# EAGLE design Carrier Board (EAGLE 9.6.2)

## Sheet 1 of 5: Sensors
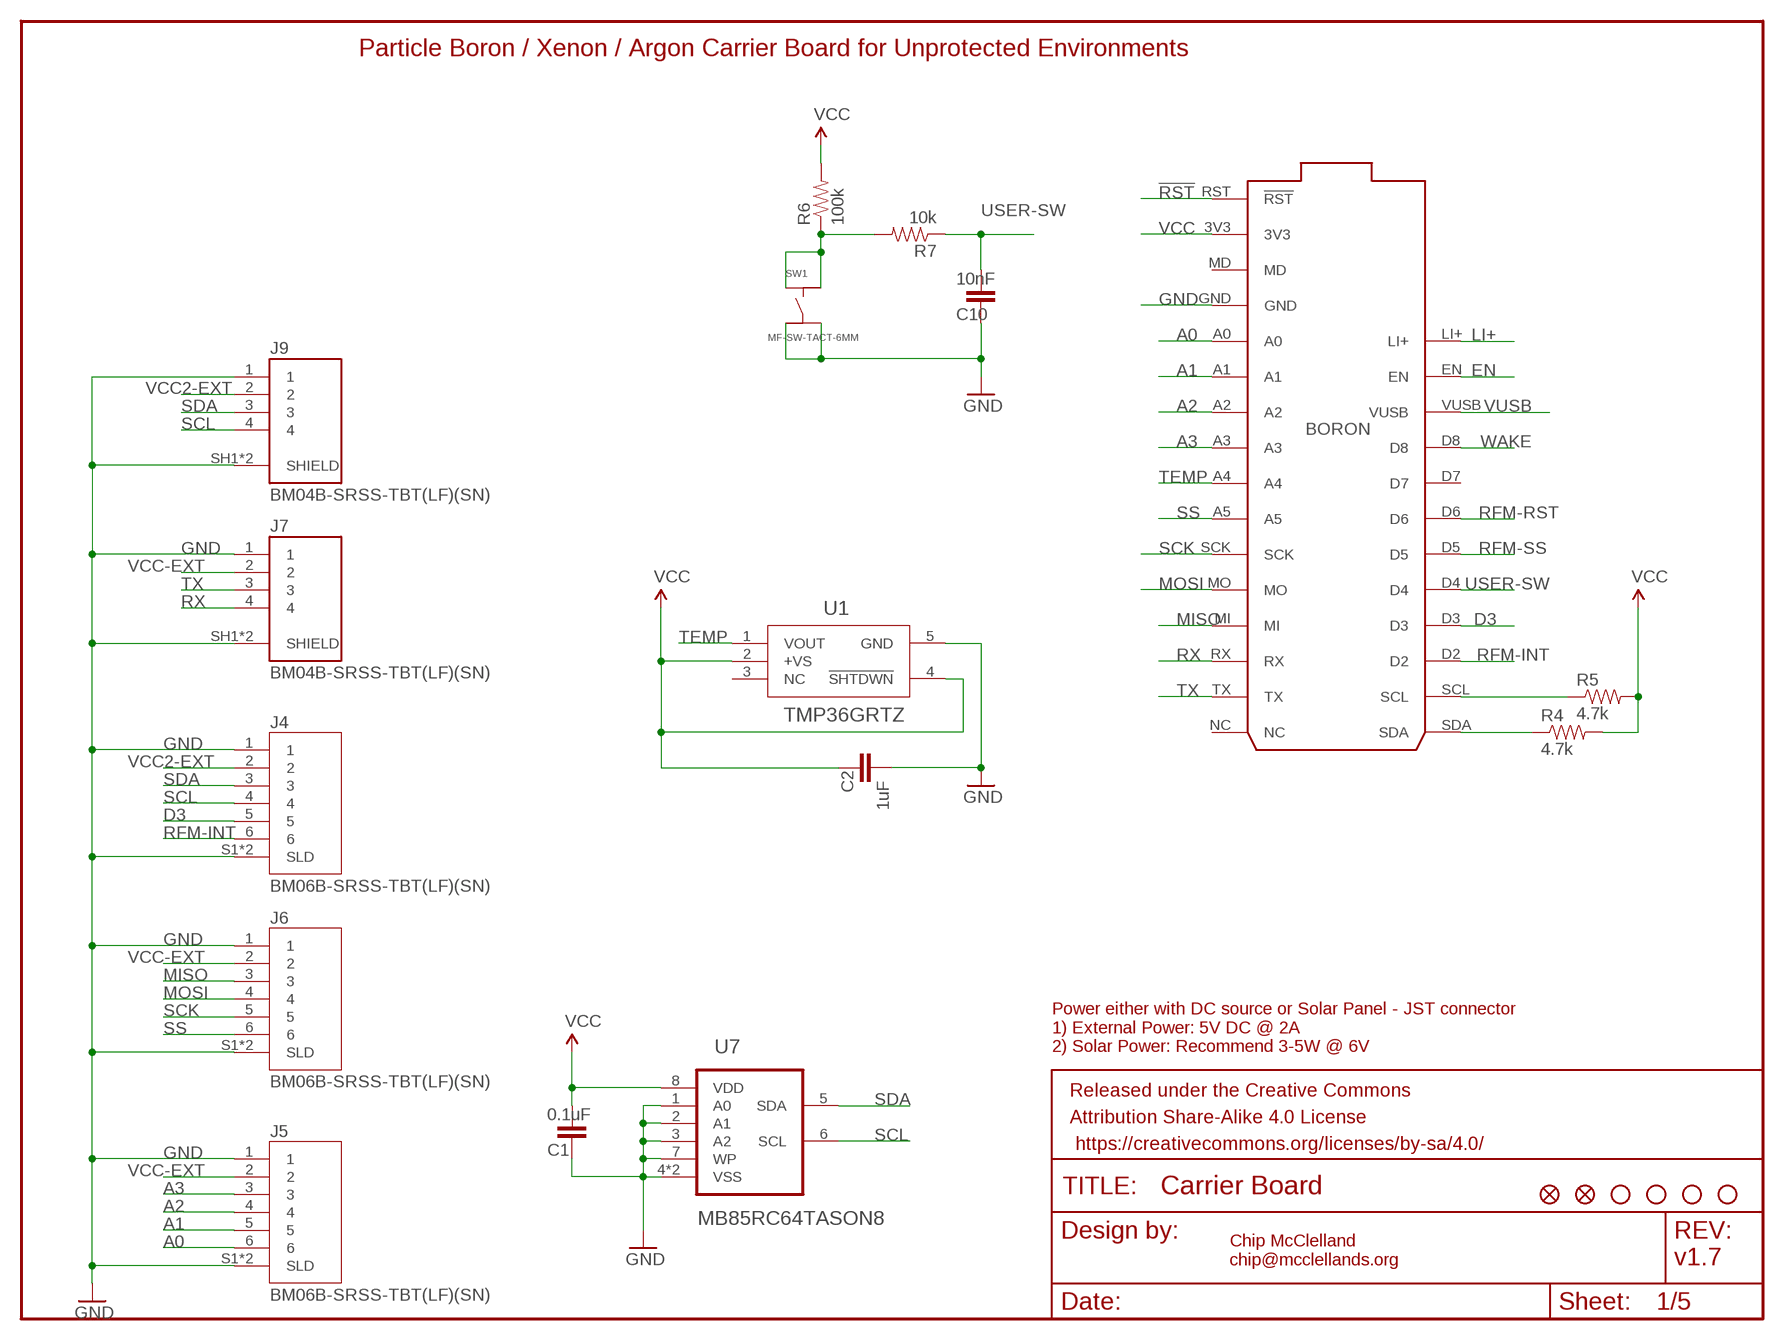
[diagram p0: schematic, sheet 1]

### Parts
C1  0.1uF  CAP-MF-0.1UF-0805  [0805@1]
C2  1uF  CAP-MF-1UF-0805  [0805@1]
C10  10nF  CAP-10NF-0805  [0805@1]
FD1  FIDUCIALUFIDUCIAL  [FIDUCIAL-MICRO]
FD2  FIDUCIALUFIDUCIAL  [FIDUCIAL-MICRO]
FRAME1  FRAME-LETTER  [CREATIVE_COMMONS]
J4  BM06B-SRSS-TBT(LF)(SN)  [JST_BM06B-SRSS-TB(LF)(SN)]
J5  BM06B-SRSS-TBT(LF)(SN)  [JST_BM06B-SRSS-TB(LF)(SN)]
J6  BM06B-SRSS-TBT(LF)(SN)  [JST_BM06B-SRSS-TB(LF)(SN)]
J7  BM04B-SRSS-TBT(LF)(SN)  [CONN_BM04B-SRSS-TBT(LF)(SN)]
J9  BM04B-SRSS-TBT(LF)(SN)  [CONN_BM04B-SRSS-TBT(LF)(SN)]
JP3  STAND-OFF  [STAND-OFF]
JP4  STAND-OFF  [STAND-OFF]
JP5  STAND-OFF  [STAND-OFF]
JP6  STAND-OFF  [STAND-OFF]
P1  Particle Boron / Xenon / Argon  PARTICLE-DEVICES-BORON  [PARTICLE-DEVICES_BORON]
R4  4.7k  RESISTOR-MF-4.7K-0805  [0805]
R5  4.7k  RESISTOR-MF-4.7K-0805  [0805]
R6  100k  RESISTOR-MF-100K-0805  [0805]
R7  10k  RESISTOR-MF-10K-0805  [0805]
SW1  MF-SW-TACT-6MM  TACT_6MM  [TACT6MM]
U1  TMP36GRTZ  TMP36GRTZ-REEL7  [RJ_5_ADI]
U7  MB85RC64TASON8  [SON50P200X300X75-9N]

### Nets
!RST: P1.RST(!RST) ; also sheet 4
A0: J5.6 P1.A0
A1: J5.5 P1.A1
A2: J5.4 P1.A2
A3: J5.3 P1.A3
D3: J4.5 P1.D3 ; also sheet 3
EN: P1.EN ; also sheet 4
GND: C1.2 C2.2 C10.2 J4.1 J4.S1(SLD) J4.S2(SLD) J5.1 J5.S1(SLD) J5.S2(SLD) J6.1 J6.S1(SLD) J6.S2(SLD) J7.1 J7.SH1(SHIELD) J7.SH2(SHIELD) J9.1 J9.SH1(SHIELD) J9.SH2(SHIELD) P1.GND SW1.P$3 SW1.P$4 U1.5(GND) U7.1(A0) U7.2(A1) U7.3(A2) U7.4(VSS) U7.7(WP) U7.9(VSS) ; also sheet 2,3,4
LI+: P1.LI+ ; also sheet 3
MISO: J6.3 P1.MI ; also sheet 2
MOSI: J6.4 P1.MO ; also sheet 2
N$4: R6.1 R7.2 SW1.P$1 SW1.P$2
RFM-INT: J4.6 P1.D2 ; also sheet 2,3
RFM-RST: P1.D6 ; also sheet 2
RFM-SS: P1.D5 ; also sheet 2
RX: J7.4 P1.RX
SCK: J6.5 P1.SCK ; also sheet 2
SCL: J4.4 J9.4 P1.SCL R5.1 U7.6(SCL) ; also sheet 3,4
SDA: J4.3 J9.3 P1.SDA R4.1 U7.5(SDA) ; also sheet 3,4
SS: J6.6 P1.A5
TEMP: P1.A4 U1.1(VOUT)
TX: J7.3 P1.TX
USER-SW: C10.1 P1.D4 R7.1
VCC: C1.1 C2.1 P1.3V3 R4.2 R5.2 R6.2 U1.2(+VS) U1.4(!SHTDWN) U7.8(VDD) ; also sheet 2,3
VCC2-EXT: J4.2 J9.2 ; also sheet 3
VCC-EXT: J5.2 J6.2 J7.2 ; also sheet 3
VUSB: P1.VUSB ; also sheet 3
WAKE: P1.D8 ; also sheet 4
Unconnected: P1.D7 P1.MD P1.NC U1.3(NC)

### Notes on the sheet
- Particle Boron / Xenon / Argon Carrier Board for Unprotected Environments
- Power either with DC source or Solar Panel - JST connector
  1) External Power: 5V DC @ 2A 
  2) Solar Power: Recommend 3-5W @ 6V
- Chip McClelland
  chip@mcclellands.org
- v1.7

## Sheet 2 of 5
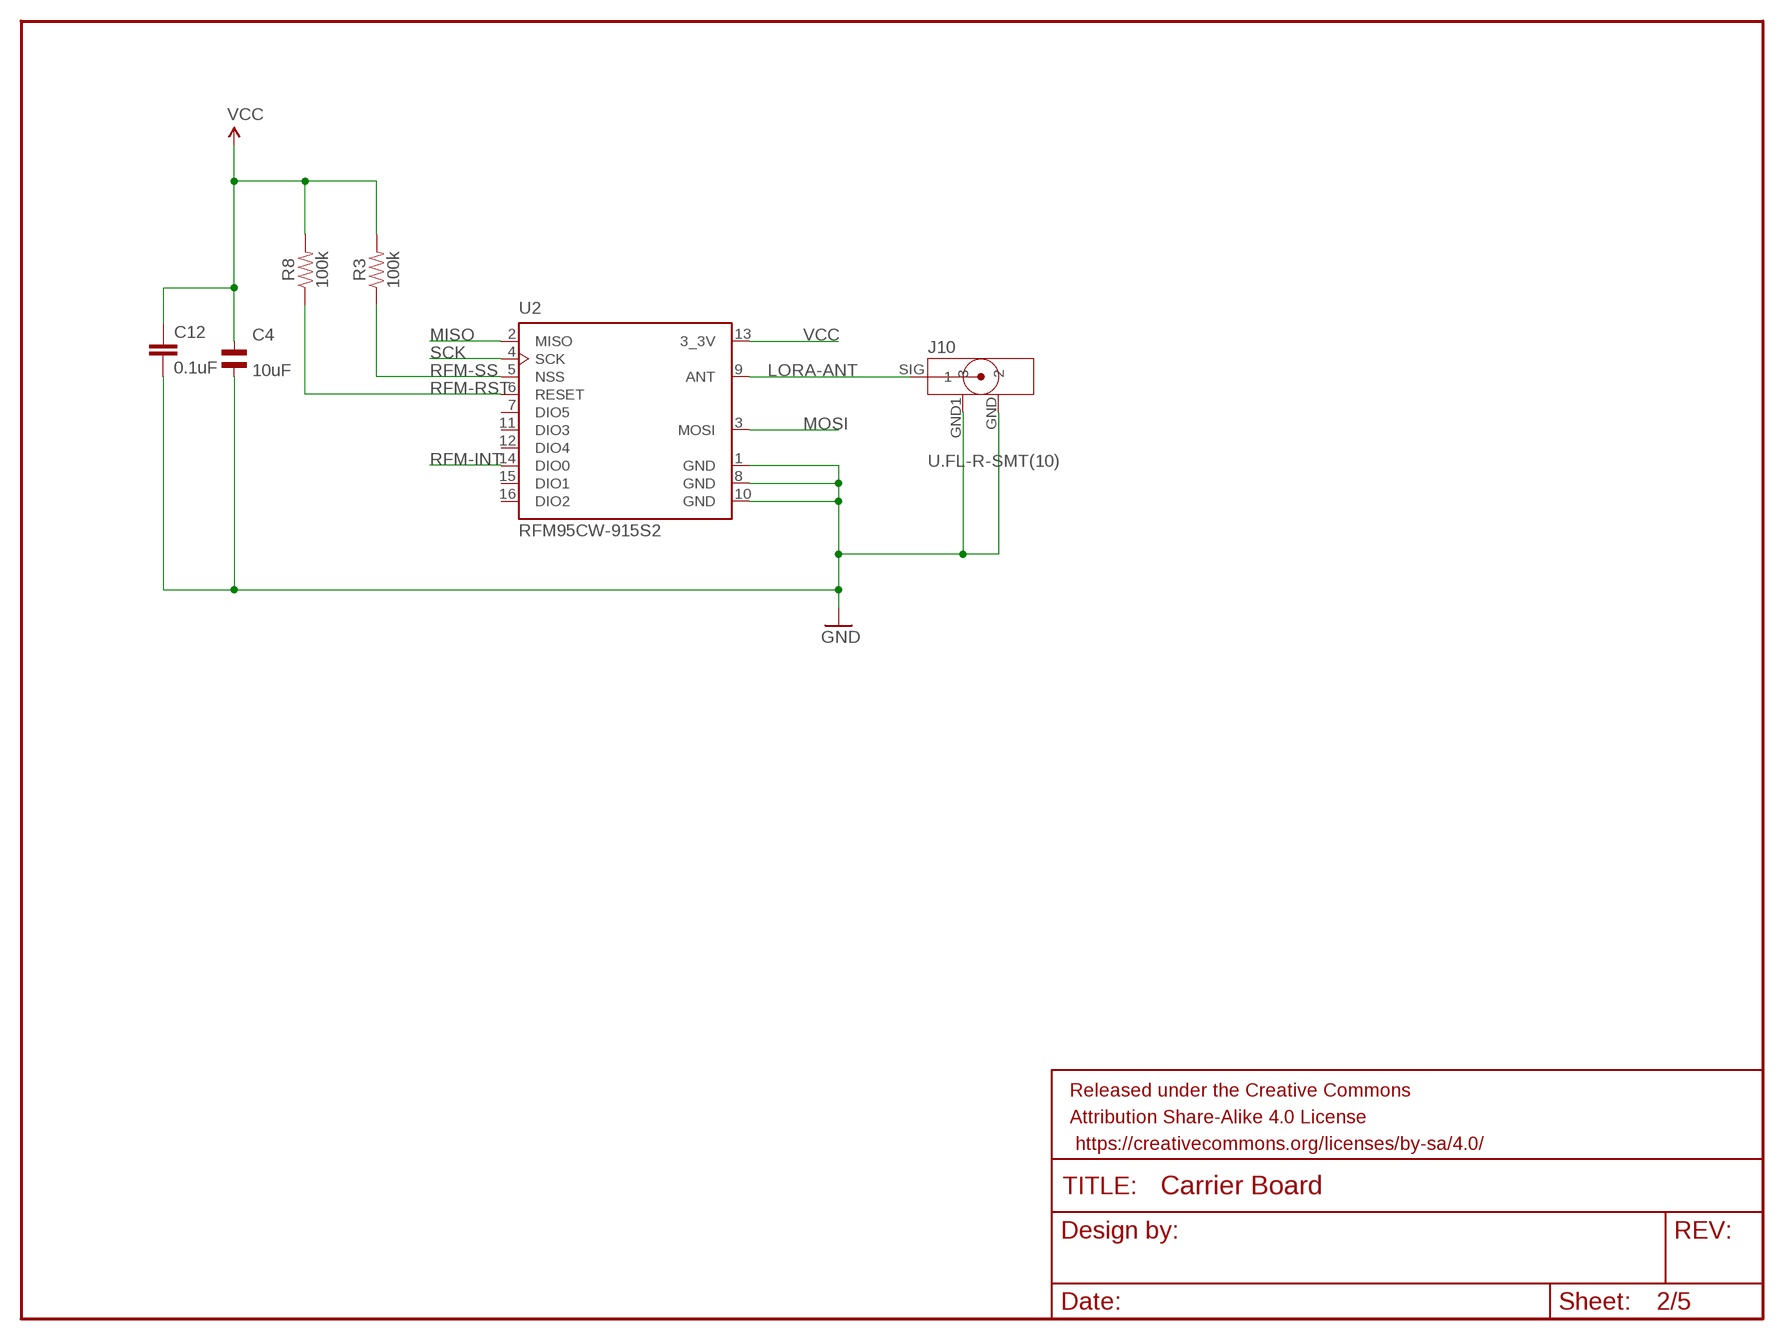
[diagram p1: schematic, sheet 2]

### Parts
C4  10uF  CAP-MF-10UF-1206  [C1206]
C12  0.1uF  CAP-MF-0.1UF-0805  [0805@1]
FRAME4  FRAME-LETTERNO_PACKAGE  [DUMMY]
J10  U.FL-R-SMT(10)  [U.FL-R-SMT(10)]
R3  100k  RESISTOR-MF-100K-0805  [0805]
R8  100k  RESISTOR-MF-100K-0805  [0805]
U2  RFM95CW-915S2  RFM95W-868S2  [XCVR_RFM95W-868S2]

### Nets
GND: C4.P$2 C12.2 J10.GND J10.GND1 U2.1(GND) U2.8(GND) U2.10(GND) ; also sheet 1,3,4
LORA-ANT: J10.SIG U2.9(ANT)
MISO: U2.2(MISO) ; also sheet 1
MOSI: U2.3(MOSI) ; also sheet 1
RFM-INT: U2.14(DIO0) ; also sheet 1,3
RFM-RST: R8.1 U2.6(RESET) ; also sheet 1
RFM-SS: R3.1 U2.5(NSS) ; also sheet 1
SCK: U2.4(SCK) ; also sheet 1
VCC: C4.P$1 C12.1 R3.2 R8.2 U2.13(3_3V) ; also sheet 1,3
Unconnected: U2.7(DIO5) U2.11(DIO3) U2.12(DIO4) U2.15(DIO1) U2.16(DIO2)

## Sheet 3 of 5: Power Control
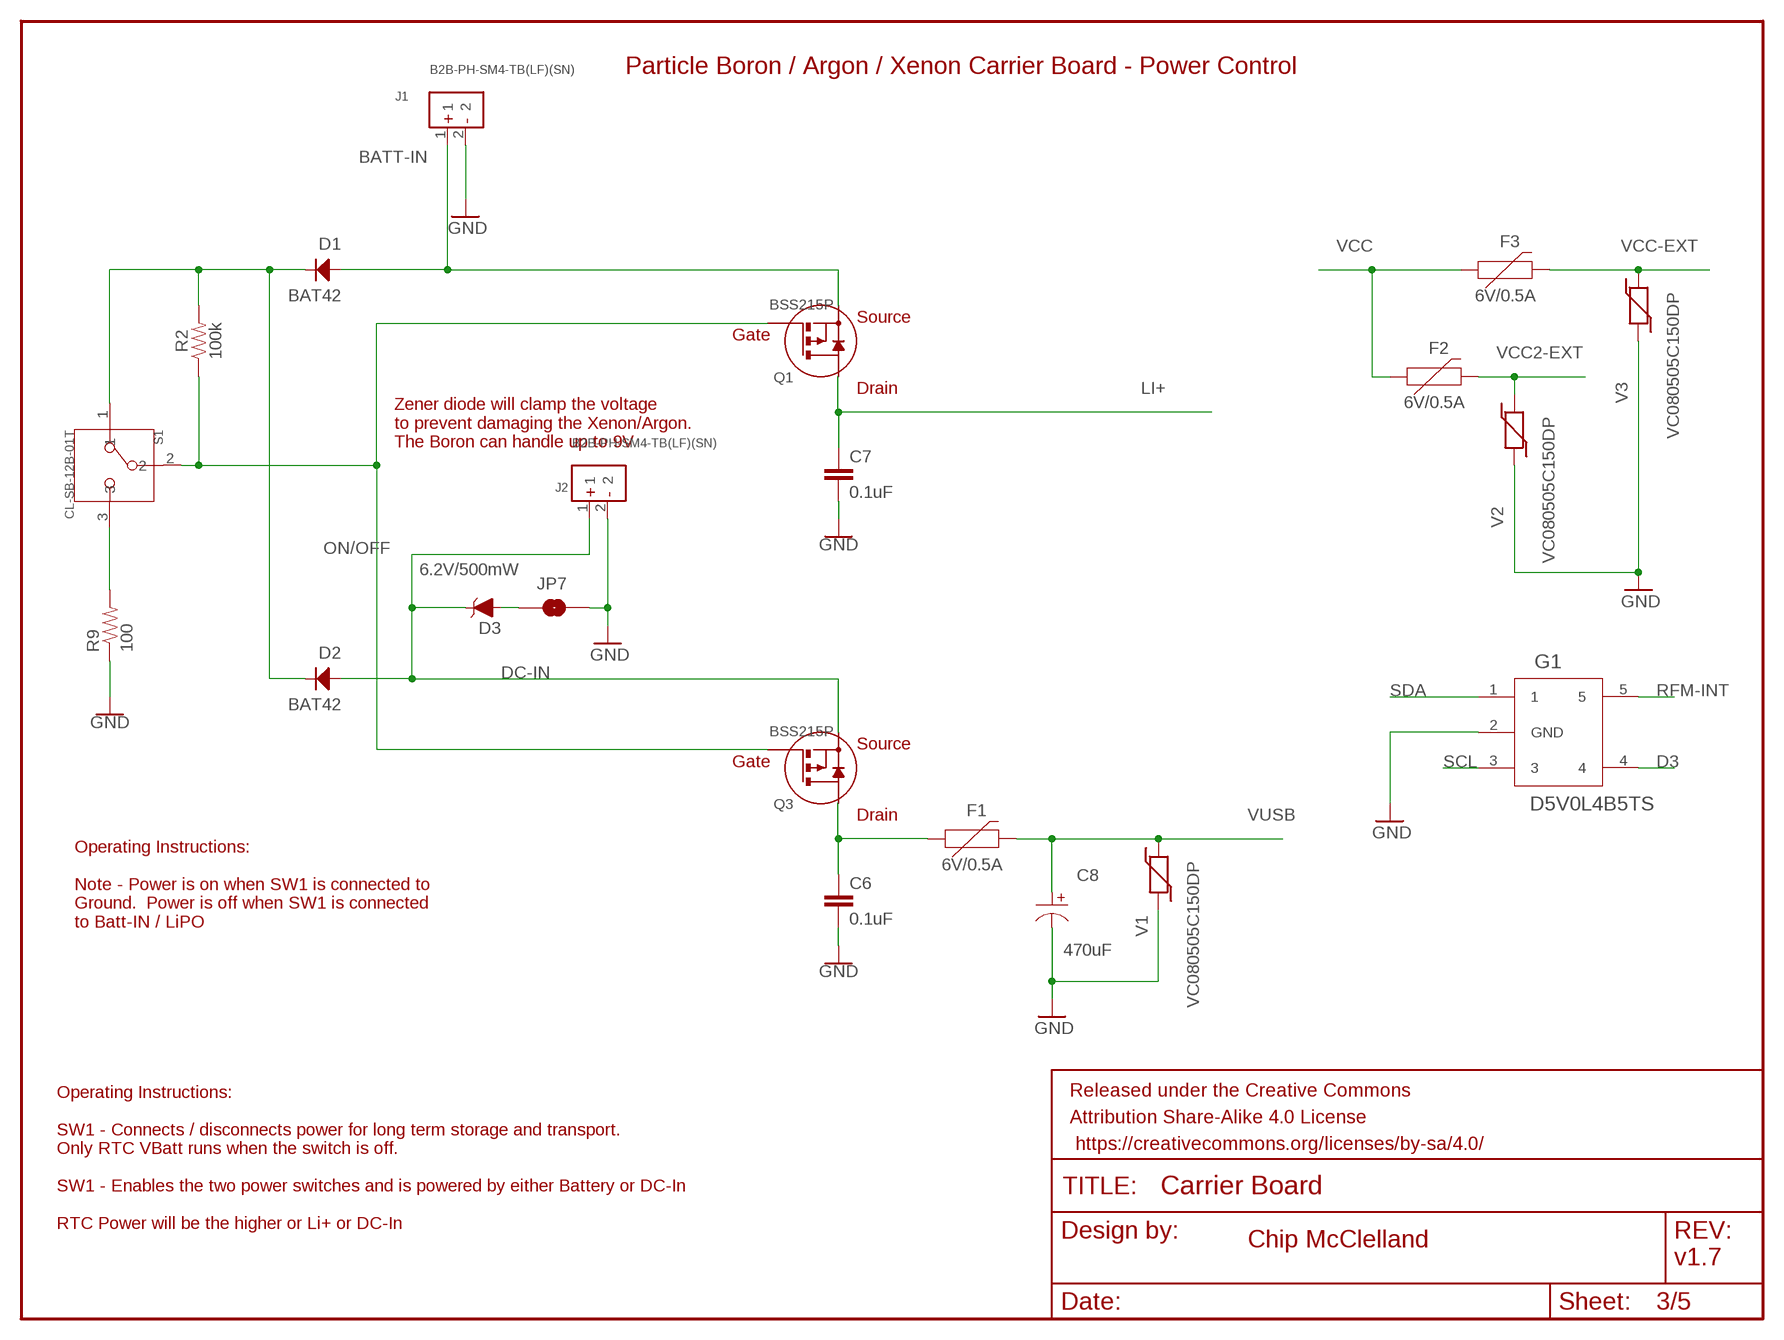
[diagram p2: schematic, sheet 3]

### Parts
C6  0.1uF  CAP-MF-0.1UF-0805  [0805@1]
C7  0.1uF  CAP-MF-0.1UF-0805  [0805@1]
C8  470uF  CAPACITOR_P_10MM  [CP10MM]
D1  BAT42  DIODES_BAT42_SOD-123  [SOD-123]
D2  BAT42  DIODES_BAT42_SOD-123  [SOD-123]
D3  6.2V/500mW  DIODE-ZENER-DZ2J150M0L  [PANASONIC_SMINI2-F5-B]
F1  6V/0.5A  PPTC_HALF-AMP  [1206]
F2  6V/0.5A  PPTC_HALF-AMP  [1206]
F3  6V/0.5A  PPTC_HALF-AMP  [1206]
FRAME2  FRAME-LETTER  [CREATIVE_COMMONS]
G1  D5V0L4B5TS  [SOT-23-5]
J1  B2B-PH-SM4-TB(LF)(SN)  [JST_B2B-PH-SM4-TB(LF)(SN)]
J2  B2B-PH-SM4-TB(LF)(SN)  [JST_B2B-PH-SM4-TB(LF)(SN)]
JP7  JUMPER-SMT_2_NO_SILK  [SMT-JUMPER_2_NO_SILK]
Q1  BSS215P  [SOT-23_3L_ONS-M]
Q3  BSS215P  [SOT-23_3L_ONS-M]
R2  100k  RESISTOR-MF-100K-0805  [0805]
R9  100  RESISTOR-MF-100-0805  [0805]
S1  CL-SB-12B-01T  [CL-SB-12B]
V1  VC080505C150DP  VARISTOR  [0805]
V2  VC080505C150DP  VARISTOR  [0805]
V3  VC080505C150DP  VARISTOR  [0805]

### Nets
BATT-IN: D1.ANODE J1.1 Q1.2(SOURCE) ; also sheet 4
D3: G1.4 ; also sheet 1
DC-IN: D2.ANODE D3.C J2.1 Q3.2(SOURCE)
GND: C6.2 C7.2 C8.P$2 G1.2(GND) J1.2 J2.2 JP7.1 R9.1 V1.1 V2.1 V3.1 ; also sheet 1,2,4
LI+: C7.1 Q1.3(DRAIN) ; also sheet 1
N$1: D3.A JP7.2
N$5: C6.1 F1.1 Q3.3(DRAIN)
N$9: D1.CATHODE D2.CATHODE R2.2 S1.1
N$12: R9.2 S1.3
ON/OFF: Q1.1(GATE) Q3.1(GATE) R2.1 S1.2
RFM-INT: G1.5 ; also sheet 1,2
SCL: G1.3 ; also sheet 1,4
SDA: G1.1 ; also sheet 1,4
VCC: F2.1 F3.1 ; also sheet 1,2
VCC2-EXT: F2.2 V2.2 ; also sheet 1
VCC-EXT: F3.2 V3.2 ; also sheet 1
VUSB: C8.P$1 F1.2 V1.2 ; also sheet 1

### Notes on the sheet
- Particle Boron / Argon / Xenon Carrier Board - Power Control
- Zener diode will clamp the voltage
  to prevent damaging the Xenon/Argon.  
  The Boron can handle up to 9V
- Operating Instructions:
  
  Note - Power is on when SW1 is connected to
  Ground.  Power is off when SW1 is connected
  to Batt-IN / LiPO
- Operating Instructions:
  
  SW1 - Connects / disconnects power for long term storage and transport.  
  Only RTC VBatt runs when the switch is off.
  
  SW1 - Enables the two power switches and is powered by either Battery or DC-In
  
  RTC Power will be the higher or Li+ or DC-In
- Chip McClelland
- v1.7

## Sheet 4 of 5: Real Time Clock
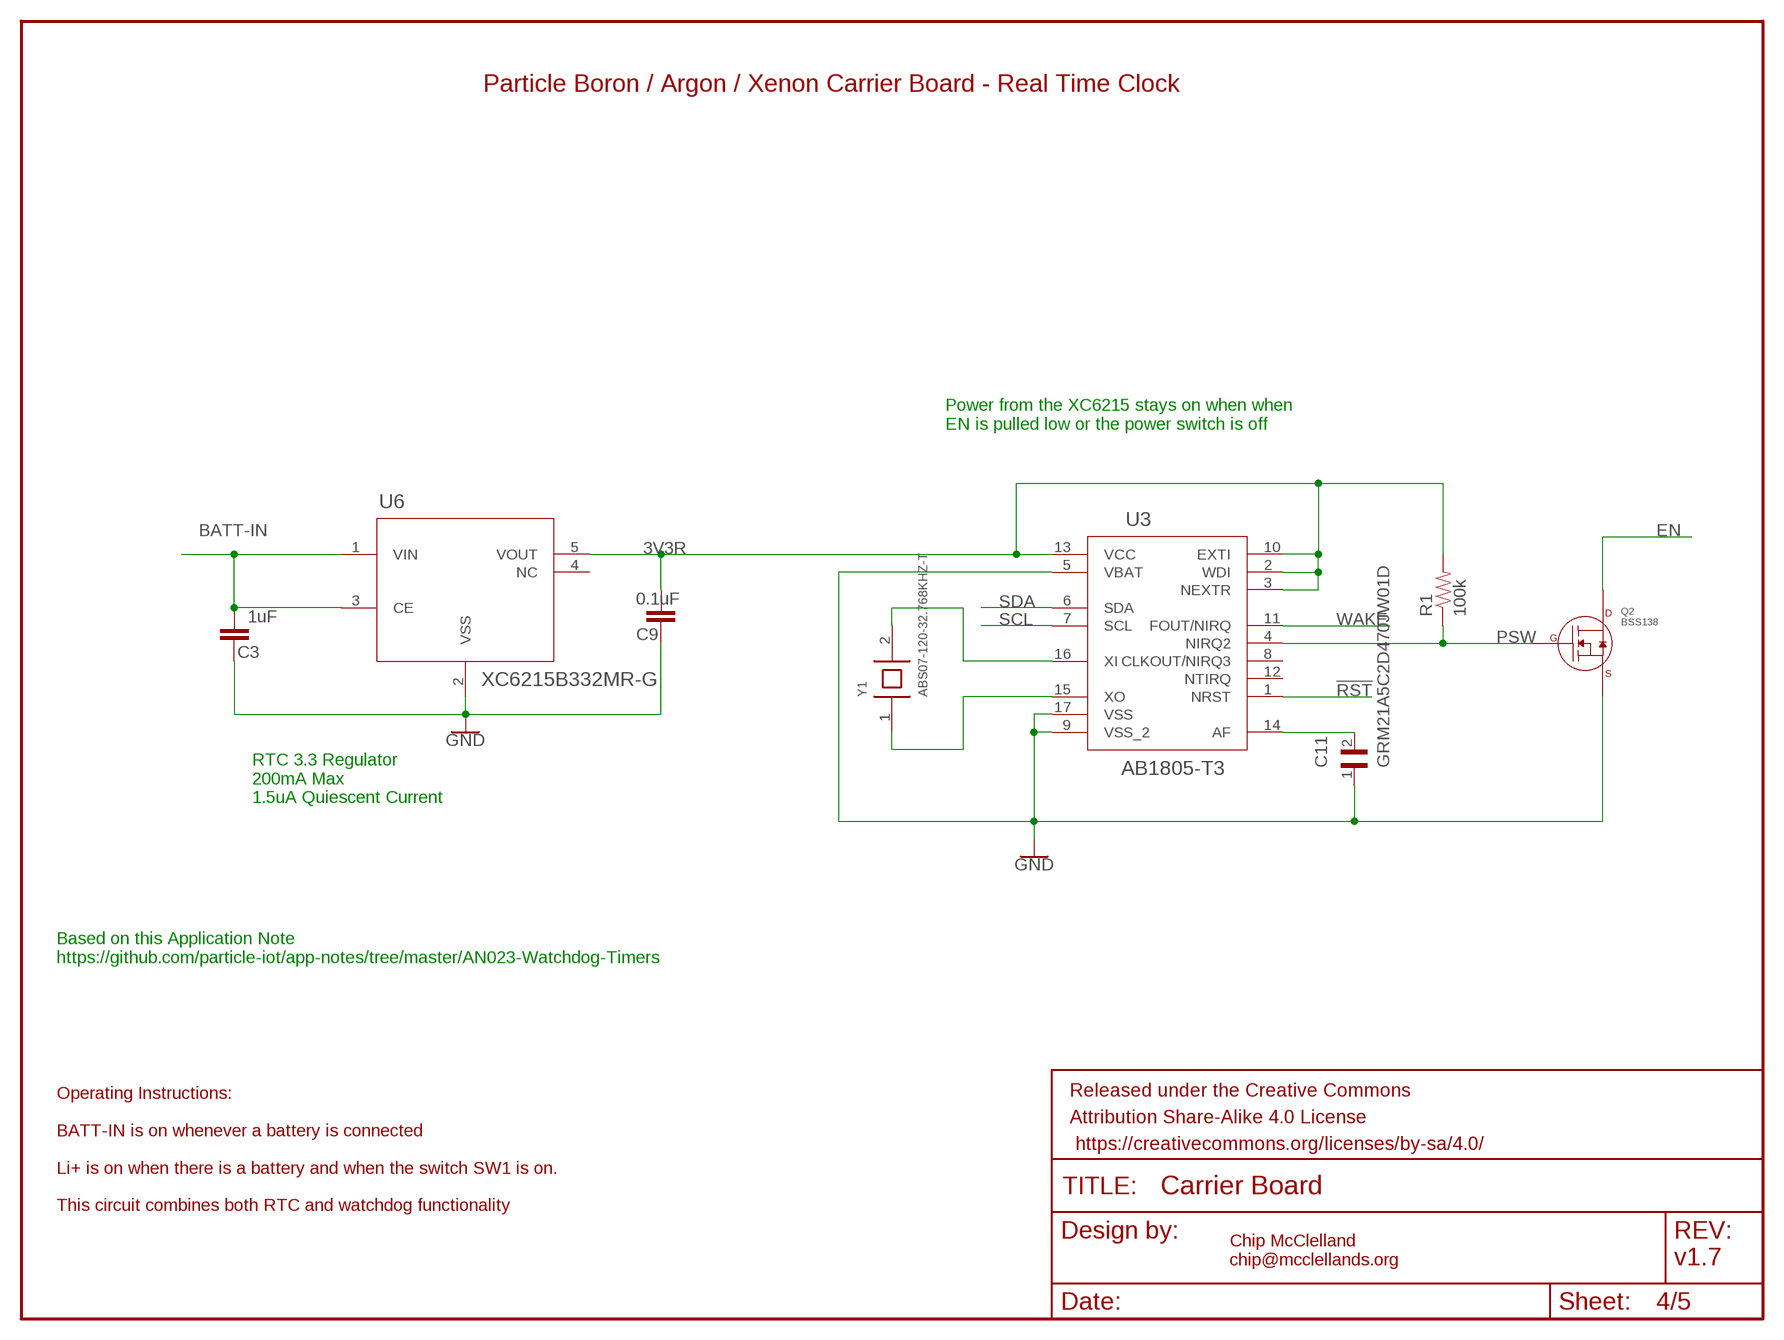
[diagram p3: schematic, sheet 4]

### Parts
C3  1uF  CAP-MF-1UF-0805  [0805@1]
C9  0.1uF  CAP-MF-0.1UF-0805  [0805@1]
C11  GRM21A5C2D470JW01D  [CAPC2012X100N]
FRAME3  FRAME-LETTER  [CREATIVE_COMMONS]
Q2  BSS138  [SOT-23_3L_ONS]
R1  100k  RESISTOR-MF-100K-0805  [0805]
U3  AB1805-T3  [QFN_16_ABR]
U6  XC6215B332MR-G  [SOT-25_TOR]
Y1  ABS07-120-32.768KHZ-T  [XTAL_ABS07-120-32.768KHZ-T]

### Nets
3V3R: C9.1 R1.2 U3.2(WDI) U3.3(NEXTR) U3.10(EXTI) U3.13(VCC) U6.5(VOUT)
!RST: U3.1(NRST) ; also sheet 1
BATT-IN: C3.2 U6.1(VIN) U6.3(CE) ; also sheet 3
EN: Q2.3(DRAIN) ; also sheet 1
GND: C3.1 C9.2 C11.1 Q2.2(SOURCE) U3.5(VBAT) U3.9(VSS_2) U3.17(VSS) U6.2(VSS) ; also sheet 1,2,3
N$2: U3.15(XO) Y1.1
N$6: U3.16(XI) Y1.2
N$11: C11.2 U3.14(AF)
PSW: Q2.1(GATE) R1.1 U3.4(NIRQ2)
SCL: U3.7(SCL) ; also sheet 1,3
SDA: U3.6(SDA) ; also sheet 1,3
WAKE: U3.11(FOUT/NIRQ) ; also sheet 1
Unconnected: U3.8(CLKOUT/NIRQ3) U3.12(NTIRQ) U6.4(NC)

### Notes on the sheet
- Particle Boron / Argon / Xenon Carrier Board - Real Time Clock
- Power from the XC6215 stays on when when
  EN is pulled low or the power switch is off
- RTC 3.3 Regulator
  200mA Max
  1.5uA Quiescent Current
- Based on this Application Note
  https://github.com/particle-iot/app-notes/tree/master/AN023-Watchdog-Timers
- Operating Instructions:
  
  BATT-IN is on whenever a battery is connected
  
  Li+ is on when there is a battery and when the switch SW1 is on.
  
  This circuit combines both RTC and watchdog functionality
- Chip McClelland
  chip@mcclellands.org
- v1.7

## Sheet 5 of 5
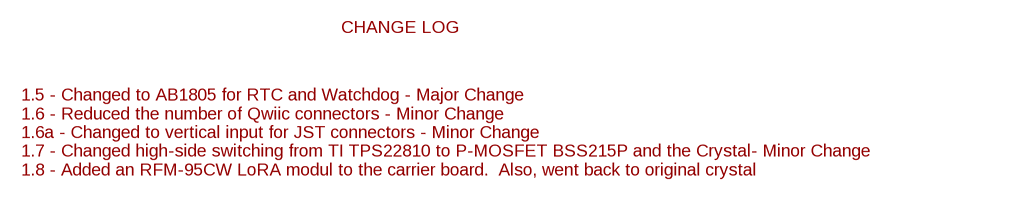
[diagram p4: schematic, sheet 5]

### Notes on the sheet
- CHANGE LOG
- 1.5 - Changed to AB1805 for RTC and Watchdog - Major Change
  1.6 - Reduced the number of Qwiic connectors - Minor Change
  1.6a - Changed to vertical input for JST connectors - Minor Change
  1.7 - Changed high-side switching from TI TPS22810 to P-MOSFET BSS215P and the Crystal- Minor Change
  1.8 - Added an RFM-95CW LoRA modul to the carrier board.  Also, went back to original crystal

## Library data of the parts
C1 C9 = Custom Components:CAP-MF-0.1UF-: Capacitor Macrofab House Part (https://factory.macrofab.com/parts). Standard ceramic capacitor, and 0.1" leaded capacitor.; HOUSEPART: YES; MPN: MF-CAP-0805-0.1uF; POPULATE: 1; URL: https://factory.macrofab.com/part/MF-CAP-0805-0.1uF
C2 C3 = Custom Components:CAP-MF-1UF-: Capacitor Macrofab House Part (https://factory.macrofab.com/parts). Standard ceramic capacitor, and 0.1" leaded capacitor.; HOUSEPART: yes; MPN: MF-CAP-0805-1uF; POPULATE: 1; URL: https://factory.macrofab.com/part/MF-CAP-0805-1uF
C4 = Custom Components:CAP-MF-10UF-: Library: MF_Passives Description: Device for Non-Polarized Capacitors. Manufacture part number (MPN) can be added via Attributes. Check https://factory.macrofab.com/parts for the house parts list.; DIELECTRIC: X5R; HOUSEPART: Yes; MPN: MF-CAP-1206-10uF; POPULATE: 1; VOLTAGE: 16V
C6 C7 C12 = Custom Components:CAP-MF-0.1UF-: Capacitor Macrofab House Part (https://factory.macrofab.com/parts). Standard ceramic capacitor, and 0.1" leaded capacitor.; HOUSEPART: Yes; MPN: MF-CAP-0805-0.1uF; POPULATE: 1; URL: https://factory.macrofab.com/part/MF-CAP-0805-0.1uF
C8 = MF_Passives:CAPACITOR_P: Library: MF_Passives Description: Device for Polarized Capacitors. Manufacture part number (MPN), Voltage Rating, and Tolerance can be added via Attributes. Check https://factory.macrofab.com/parts for the house parts list.; HOUSEPART: 1; MPN: MF-CAP-10MM-470uF; POPULATE: 1
C10 = Custom Components:CAP-10NF-: Capacitor 10nF variant Standard 0805 ceramic capacitor; DIGIKEY: 399-C0805X103K1RAC3316CT-ND; HOUSEPART: No; MPN: 08051C103K4T2A; POPULATE: 1; URL: https://www.digikey.com/en/products/detail/kemet/C0805X103K1RAC3316/10315780
C11 = Custom Components:GRM21A5C2D470JW01D: Cap Ceramic 47pF 200V C0G 5% Pad SMD 0805 125C T/R; DESCRIPTION: SMD Capacitor C0G(EIA) with Capacitance: 47pF Tol. 5%. Rated Voltage: 200Vdc; DIGI-KEY_PART_NUMBER: 490-14653-1-ND; MF: Murata; MP: GRM21A5C2D470JW01D; PACKAGE: 2012 Murata; PURCHASE-URL: https://pricing.snapeda.com/search/part/GRM21A5C2D470JW01D/?ref=eda
D1 D2 = MF_Discrete_Semiconductor:DIODES: Library: MF_Discrete_Semiconductor Description: Device for Single Packaged Diodes.; HOUSEPART: YES; MPN: MF-DIO-SOD123-BAT42; POPULATE: 1; URL: https://factory.macrofab.com/part/MF-DIO-SOD123-BAT42; VALUE: MF-DIO-SOD123-BAT42
D3 = SparkFun-DiscreteSemi:DIODE-ZENER: Zener Diode A Zener diode allows current to flow from its anode to its cathode like a normal semiconductor diode, but it also permits current to flow in the reverse direction when its "Zener voltage" is reached. - WIkipedia; MPN: TDZ6V2J,115; POPULATE: 1; PROD_ID: DIO-12989; VALUE: 15V
F1 = SparkFun-Fuses:PPTC: Resettable Fuse PPTC Resettable Fuse. Really a sort of resistor with a polymeric positive temperature coefficient whose resistance increases dramatically with an increase in temperature. When heated by the power passing through the resistance rises causing the current to be limited, protecting the circuit. This is achieved by the transition of the polymer from a crystalline to an amorphous state where the conductive carbon separates breaking the conductive pathways found in the cool crystalline structure. When a PPTC cools back down it resumes conducting letting the circuit turn back on. SparkFun Products: SparkFun RedBoard - Programmed with Arduino <https://www.sparkfun.com/products/12757> Pro Micro - 5V/16MHz <https://www.sparkfun.com/products/12640> Arduino Pro 328 - 5V/16MHz <https://www.sparkfun.com/products/10915> MP3 Trigger <https://www.sparkfun.com/products/13720>; MPN: 046801.5NR; PROD_ID: RES-08585
F2 F3 = SparkFun-Fuses:PPTC: Resettable Fuse PPTC Resettable Fuse. Really a sort of resistor with a polymeric positive temperature coefficient whose resistance increases dramatically with an increase in temperature. When heated by the power passing through the resistance rises causing the current to be limited, protecting the circuit. This is achieved by the transition of the polymer from a crystalline to an amorphous state where the conductive carbon separates breaking the conductive pathways found in the cool crystalline structure. When a PPTC cools back down it resumes conducting letting the circuit turn back on. SparkFun Products: SparkFun RedBoard - Programmed with Arduino <https://www.sparkfun.com/products/12757> Pro Micro - 5V/16MHz <https://www.sparkfun.com/products/12640> Arduino Pro 328 - 5V/16MHz <https://www.sparkfun.com/products/10915> MP3 Trigger <https://www.sparkfun.com/products/13720>; MPN: 0466.500NR; PROD_ID: RES-08585
FD1 FD2 = SparkFun-Aesthetics:FIDUCIAL: Fiducial Alignment Points Point-of-reference for pick-and-place machines and other optical instruments.; POPULATE: 0
FRAME1-FRAME3 = SparkFun-Aesthetics:FRAME-LETTER: Schematic Frame - Letter Standard 8.5x11 US Letter frame; POPULATE: 0
FRAME4 = SparkFun-Aesthetics:FRAME-LETTER: Schematic Frame - Letter Standard 8.5x11 US Letter frame; DESIGNER: Nobody; VERSION: v01
G1 = Custom Components:D5V0L4B5TS: 4 CHANNEL LOW CAPACITANCE BI-DIRECTIONAL TVS ARRAY; MPN: D5V0L4B5TS-7
J1 J2 = Custom Components:B2B-PH-SM4-TB(LF)(SN): PH Series 2 Position 2 mm Pitch Surface Mount Top Entry Shrouded Header; DESCRIPTION: Connector Header Surface Mount 2 position 0.079 (2.00mm); DIGI-KEY_PART_NUMBER: 455-1734-1-ND; MF: JST Sales; MP: B2B-PH-SM4-TB(LF)(SN); PACKAGE: None; PURCHASE-URL: https://pricing.snapeda.com/search/part/B2B-PH-SM4-TB(LF)(SN)/?ref=eda
J4-J6 = Custom Components:BM06B-SRSS-TBT(LF)(SN): 6 Position 1.0mm Top-Entry Surface Mount Shrouded Header; MPN: BM06B-SRSS-TBT(LF)(SN); POPULATE: 1
J7 J9 = Custom Components:BM04B-SRSS-TBT(LF)(SN): 1.0mm Pitch, Ultra-Compact, Low Profile Design, Interchangeable Shrouded Header; DESCRIPTION: 1.0mm Pitch, Ultra-Compact, Low Profile Design, Interchangeable Shrouded Header; MF: JST Sales; MP: BM04B-SRSS-TBT(LF)(SN); PACKAGE: None; POPULATE: 1; PRICE: None
J10 = Connectors:U.FL-R-SMT(10): CONN U.FL RCPT STR 50 OHM SMD Manufacturer's datasheet <https://media.digikey.com/pdf/Data%20Sheets/Hirose%20PDFs/UFL%20Series.pdf>; CREATED_BY: PCBLayout.com; DIGIKEY_PART_NUMBER: H9161CT-ND; MANUFACTURER: Hirose Electric Co Ltd; MPN: U.FL-R-SMT(10); PACKAGE: SMD
JP3-JP6 = SparkFun-Hardware:STAND-OFF: Stand Off Drill holes for mechanically mounting via screws, standoffs, etc. Note: Use the keepout ring to avoid running the screw head into surrounding components. Variant Overviews STAND-OFF - Mechanical footprint for a #4 phillips button head screw. STAND-OFF-TIGHT - Mechanical footprint for a #4 phillips button head screw, Example SparkFun Products Screw - Phillips Head (1/4", 4-40, 10 pack) <https://www.sparkfun.com/products/10453> (PRT-10453) Screw - Phillips Head (1/2", 4-40, 10 pack) <https://www.sparkfun.com/products/10452> (PRT-10452) Screw - Phillips Head (3/4", 4-40, 10 pack) <https://www.sparkfun.com/products/10451> (PRT-10451) Screw - Phillips Head (1", 4-40, 10 pack) <https://www.sparkfun.com/products/10450> (PRT-10450); POPULATE: 0
JP7 = SparkFun-Jumpers:JUMPER-SMT_2_NO: Normally open jumper This jumper has two pads in close proximity to each other. Apply solder to close the connection. Round pads are easier to solder for beginners, but are a lot larger. SparkFun Product that uses the round pads: SparkFun EL Sequencer <https://www.sparkfun.com/products/12781>; POPULATE: 0
P1 = Custom Components:PARTICLE-DEVICES-BORON: Particle Boron Device for Carrier Board Placement; POPULATE: 0
Q1 Q3 = Custom Components:BSS215P; HOUSEPART: No; MPN: BSS215PH6327XTSA1; PKG: SOT-23; POPULATE: 1
Q2 = Custom Components:BSS138; BUILT_BY: EMA_Justin; COPYRIGHT: Copyright (C) 2018 Accelerated Designs. All rights reserved; DATASHEET: https://www.onsemi.com/pub/Collateral/BSS138-D.PDF; MANUFACTURER_PART_NUMBER: BSS138; MPN: MF-DSC-SOT233-BSS138; SOURCELIBRARY: ON_Semiconductor_2020-01-13; VENDOR: ON Semiconductor
R1 R6 = Custom Components:RESISTOR-MF-100K-: Generic 0805 Resistor Package; HOUSEPART: YES; MPN: MF-RES-0805-100K; POPULATE: 1; URL: https://factory.macrofab.com/part/MF-RES-0805-100K
R2 R3 R8 = Custom Components:RESISTOR-MF-100K-: Generic 0805 Resistor Package; MPN: MF-RES-0805-100K; POPULATE: 1; URL: https://factory.macrofab.com/part/MF-RES-0805-100K
R4 R5 = Custom Components:RESISTOR-MF-4.7K-: Generic 0805 Resistor Package; HOUSEPART: 1; MPN: MF-RES-0805-4.7K; POPULATE: 1; URL: https://factory.macrofab.com/part/MF-RES-0805-4.7K
R7 = Custom Components:RESISTOR-MF-10K-: Generic 0805 Resistor Package; HOUSEPART: YES; MPN: MF-RES-0805-10K; POPULATE: 1; URL: https://factory.macrofab.com/part/MF-RES-0805-10K
R9 = Custom Components:RESISTOR-MF-100-: Generic 0805 Resistor Package; HOUSEPART: Yes; MPN: MF-RES-0805-100; POPULATE: 1; URL: https://factory.macrofab.com/part/MF-RES-0805-100
S1 = Custom Components:CL-SB-12B-01T; DESCRIPTION: Switch Slide N.O./N.C. SPDT Top Slide 0.2A 12VDC Gull Wing SMD T/R; DIGI-KEY_PART_NUMBER: 563-1318-1-ND; DIGI-KEY_PURCHASE_URL: https://www.digikey.com/product-detail/en/nidec-copal-electronics/CL-SB-12B-01T/563-1318-1-ND/3507878?utm_source=snapeda&utm_medium=aggregator&utm_campaign=symbol; MF: Nidec Copal; MP: CL-SB-12B-01T; PACKAGE: None
SW1 = MF_Switches:TACT: Library: MF_Switches Description: Device for Tact Switches. Manufacture part number (MFG#) can be added via Attributes.; HOUSEPART: YES; MPN: MF-SW-TACT-6MM; POPULATE: 1; URL: https://factory.macrofab.com/part/MF-SW-TACT-6MM
U1 = Custom Components:TMP36GRTZ-REEL7; BUILT_BY: EMA_UL_Team; MANUFACTURER_PART_NUMBER: TMP36GRTZ-REEL7; MPN: TMP36GRTZ-REEL7; SOURCELIBRARY: Analog_2012-01-01_9; VENDOR: Analog Devices Inc
U2 = Custom Components:RFM95W-868S2: Mod Txrx Lora +20dbm 868mhz Smd Check availability <https://pricing.snapeda.com/parts/RFM95W-868S2/RF%20Solutions/view-part?ref=eda>; AVAILABILITY: In Stock; DESCRIPTION: General ISM < 1GHz LoRa™ Transceiver Module 868MHz Antenna Not Included Surface Mount; MF: RF Solutions; MP: RFM95W-868S2; PACKAGE: SMD-16 RF Solutions; PRICE: None; PURCHASE-URL: https://pricing.snapeda.com/search/part/RFM95W-868S2/?ref=eda
U3 = Custom Components:AB1805-T3; BUILT_BY: Sunstream; DESCRIPTION: IC RTC CLK/CALENDAR I2C 16-QFN; MANUFACTURER: Abracon LLC; MANUFACTURER_PART_NUMBER: AB1805-T3; SOURCELIBRARY: Abracon_2019-05-15; VENDOR: Abracon
U6 = Custom Components:XC6215B332MR-G; BUILT_BY: EMA_UL_Team; MANUFACTURER_PART_NUMBER: XC6215B332MR-G; SOURCELIBRARY: Torex_2016-07-08_1; VENDOR: Torex Semiconductor
U7 = Custom Components:MB85RC64TA
V1-V3 = Custom Components:VARISTOR; MPN: VC080505C150DP; POPULATE: 1
Y1 = Custom Components:ABS07-120-32.768KHZ-T: 3.2 x 1.5mm, 32.768KHZ Xtal 6pf, 20ppm, -40+85C, ESR 60kOhm, ST Micro Ref Design Crystal for STM32L; DESCRIPTION: 32.768kHz ±20ppm Crystal 6pF 55 kOhms 2-SMD, No Lead; DIGI-KEY_PART_NUMBER: 535-11937-1-ND; MF: Abracon; MPN: ABS07-32.768KHZ-6-T; PACKAGE: SMD-2 Abracon LLC; PURCHASE-URL: https://pricing.snapeda.com/search/part/ABS07-120-32.768KHZ-T/?ref=eda

## Net classes
0 default: width 0.203 mm, drill 0.33 mm

## Board
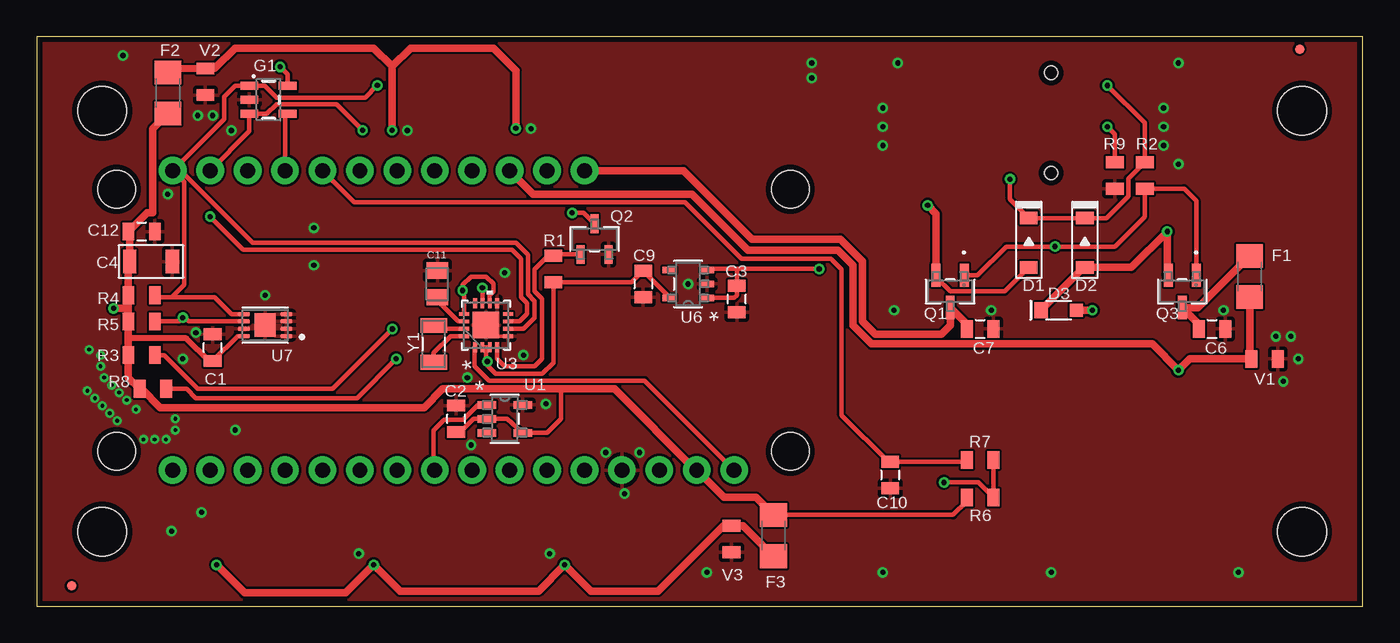
[diagram p5: board, top side]
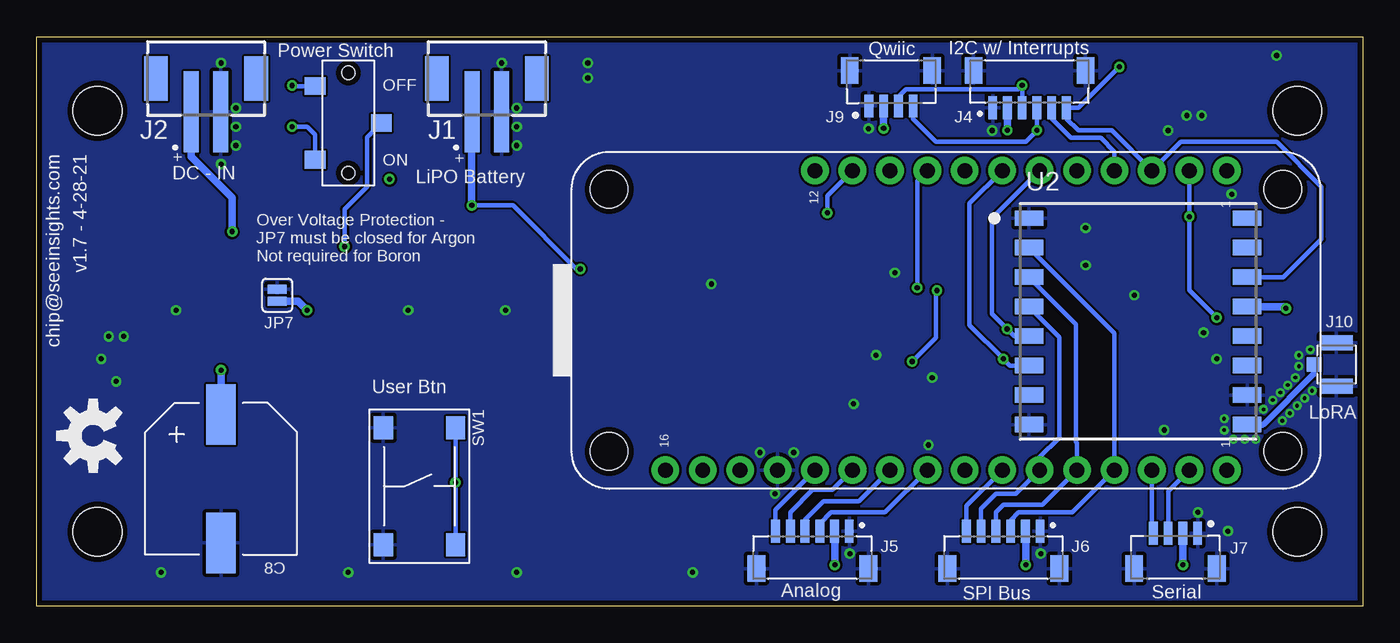
[diagram p6: board, bottom side, seen from below]

Size 89.97 x 38.61 mm. Coordinates in mm from the lower left corner, seen from the top.
Outline: 0,0 89.97,0 89.97,38.61 0,38.61 0,0
Copper layers (1*16): Top 0.0356mm / dielectric 1.5011mm / Bottom 0.0356mm
Design rules "LaenPCBOrder": minimum track width 6mil, minimum drill 13mil, track to track 6mil, track to pad 6mil, pad to pad 6mil, via to via 6mil, smd to smd 6mil, copper to edge 15mil, drill to drill 6mil, minimum pad ring 7mil, minimum via ring 7mil, stop-mask expansion 3mil, vias tented up to drill 0mil, thermal gap 10mil

### Footprints (pad centres in the part's own frame; a part is rotated, then mirrored left to right if it is on the bottom)
0805@1 = smd 0.8 x 1.2: 1 -0.9,0; 2 0.9,0
C1206 = smd 0.9 x 1.6: P$1 -1.45,0; P$2 1.45,0
CP10MM = smd 2 x 4.1: P$1 0,-4.35; P$2 0,4.35
CAPC2012X100N = smd 1.1 x 1.47: 1 -0.909,0; 2 0.909,0
SOD-123 = smd 0.85 x 1.2: ANODE 1.675,0; CATHODE -1.675,0
PANASONIC_SMINI2-F5-B = smd 0.9 x 0.9: A 1.2,0 | smd 0.9 x 1.1: C -1.2,0
1206 = smd 1.6 x 1.8: 1 -1.4,0; 2 1.4,0
FIDUCIAL-MICRO = smd 0.635 x 0.635: 1 0,0
SOT-23-5 = smd 0.55 x 1.2: 1 -0.95,-1.3; 2 0,-1.3; 3 0.95,-1.3; 4 0.95,1.3; 5 -0.95,1.3
JST_B2B-PH-SM4-TB(LF)(SN) = smd 1 x 5.5: 1 -1,0; 2 1,0 | smd 1.6 x 3: 3 -3.4,2.25; 4 3.4,2.25
JST_BM06B-SRSS-TB(LF)(SN) = smd 0.6 x 1.55: 1 -2.5,-2.525; 2 -1.5,-2.525; 3 -0.5,-2.525; 4 0.5,-2.525; 5 1.5,-2.525; 6 2.5,-2.525 | smd 1.2 x 1.8: S1 -3.8,0; S2 3.8,0
CONN_BM04B-SRSS-TBT(LF)(SN) = smd 0.6 x 1.55: 1 -1.5,-2.4; 2 -0.5,-2.4; 3 0.5,-2.4; 4 1.5,-2.4 | smd 1.2 x 1.8: SH1 -2.8,0; SH2 2.8,0
U.FL-R-SMT(10) = smd 1.05 x 2.2: GND -1.475,0; GND1 1.475,0 | smd 1 x 1: SIG 0,-1.525
STAND-OFF = hole 3.302: 0,0
SMT-JUMPER_2_NO_SILK = smd 0.635 x 1.27: 1 -0.406,0; 2 0.406,0
PARTICLE-DEVICES_BORON = drill 1.016 pad 1.88: 3V3 1.27,41.91; A0 1.27,34.29; A1 1.27,31.75; A2 1.27,29.21; A3 1.27,26.67; A4 1.27,24.13; A5 1.27,21.59; D2 21.59,11.43; D3 21.59,13.97; D4 21.59,16.51; D5 21.59,19.05; D6 21.59,21.59; D7 21.59,24.13; D8 21.59,26.67; EN 21.59,31.75; GND 1.27,36.83; LI+ 21.59,34.29; MD 1.27,39.37; MI 1.27,13.97; MO 1.27,16.51; NC 1.27,6.35; RST 1.27,44.45; RX 1.27,11.43; SCK 1.27,19.05; SCL 21.59,8.89; SDA 21.59,6.35; TX 1.27,8.89; VUSB 21.59,29.21 | hole 2.54: 2.54,2.54; 20.32,2.54; 20.32,48.26; 2.54,48.26
SOT-23_3L_ONS-M = smd 0.61 x 1.575: 1 -0.953,-1.092; 2 0.953,-1.092; 3 0,1.092
SOT-23_3L_ONS = smd 0.559 x 1.27: 1 -0.953,-1.041; 2 0.953,-1.041; 3 0,1.041
0805 = smd 0.8 x 1.2: 1 -0.9,0; 2 0.9,0
CL-SB-12B = smd 1.2 x 1.4: 1 -2.5,-2.25; 2 0,2.25; 3 2.5,-2.25 | hole 0.9: 3.4,0; -3.4,0
TACT6MM = smd 1.55 x 1.3: P$1 -3.975,2.45; P$2 3.975,2.45; P$3 -3.975,-2.45; P$4 3.975,-2.45
RJ_5_ADI = smd 1.27 x 0.508: 1 -1.219,0.95; 2 -1.219,0; 3 -1.219,-0.95; 4 1.219,-0.95; 5 1.219,0.95
XCVR_RFM95W-868S2 = smd 1.95 x 1.05: 1 -7.4,7; 2 -7.4,5; 3 -7.4,3; 4 -7.4,1; 5 -7.4,-1; 6 -7.4,-3; 7 -7.4,-5; 8 -7.4,-7; 9 7.4,-7; 10 7.4,-5; 11 7.4,-3; 12 7.4,-1; 13 7.4,1; 14 7.4,3; 15 7.4,5; 16 7.4,7
QFN_16_ABR = smd 0.686 x 0.254: 1 -1.499,0.75; 2 -1.499,0.25; 3 -1.499,-0.25; 4 -1.499,-0.75; 9 1.499,-0.75; 10 1.499,-0.25; 11 1.499,0.25; 12 1.499,0.75 | smd 0.254 x 0.686: 5 -0.75,-1.499; 6 -0.25,-1.499; 7 0.25,-1.499; 8 0.75,-1.499; 13 0.75,1.499; 14 0.25,1.499; 15 -0.25,1.499; 16 -0.75,1.499 | smd 1.8 x 1.8: 17 0,0
SOT-25_TOR = smd 0.927 x 0.432: 1 -1.289,0.95; 2 -1.289,0; 3 -1.289,-0.95; 4 1.289,-0.95; 5 1.289,0.95
SON50P200X300X75-9N = smd 0.83 x 0.27: 1 -1.44,0.75; 2 -1.44,0.25; 3 -1.44,-0.25; 4 -1.44,-0.75; 5 1.44,-0.75; 6 1.44,-0.25; 7 1.44,0.25; 8 1.44,0.75 | smd 1.4 x 1.6: 9 0,0
XTAL_ABS07-120-32.768KHZ-T = smd 1 x 1.8: 1 -1.25,0; 2 1.25,0

### Placement (x,y rotation side)
C1  11.94,17.53 90 top
C2  28.45,12.7 90 top
C3  47.5,20.83 90 top
C4  7.75,23.37 0 top
C6  79.76,18.8 0 top
C7  64.01,18.8 0 top
C8  77.47,8.64 180 bottom
C9  41.15,21.84 270 top
C10  57.91,8.89 270 top
C11  27.18,21.84 270 top
C12  7.11,25.4 0 top
D1  67.31,24.64 270 top
D2  71.12,24.64 270 top
D3  69.34,20.07 0 top
F1  82.3,22.35 270 top
F2  8.89,34.8 90 top
F3  49.99,4.78 270 top
FD1  85.7,37.77 0 top
FD2  2.36,1.37 0 top
FRAME1  16.03,-38.73 0 top  (outside the outline)
FRAME2  15.72,-51.66 0 top  (outside the outline)
FRAME3  16,-26.7 0 top  (outside the outline)
FRAME4  -40.64,-16 0 top  (outside the outline)
G1  15.72,34.34 270 top
J1  59.44,33.53 0 bottom
J2  78.49,33.53 0 bottom
J4  22.61,36.32 0 bottom
J5  37.34,2.54 180 bottom
J6  24.38,2.54 180 bottom
J7  12.7,2.54 180 bottom
J9  32,36.32 0 bottom
J10  1.78,16.38 270 bottom
JP3  85.85,33.6 0 top
JP4  85.85,5.03 90 top
JP5  4.45,33.6 0 top
JP6  4.45,5.03 0 top
JP7  73.66,21.08 270 bottom
P1  2.87,7.95 90 bottom
Q1  61.98,21.34 180 top
Q2  37.85,24.89 0 top
Q3  77.72,21.34 180 top
R1  35.05,22.86 270 top
R2  75.18,29.21 90 top
R3  7.11,17.02 180 top
R4  7.11,21.08 180 top
R5  7.11,19.3 180 top
R6  64.01,7.37 180 top
R7  64.01,9.91 0 top
R8  7.87,14.73 180 top
R9  73.15,29.21 90 top
S1  68.83,32.77 270 bottom
SW1  64.01,8.13 270 bottom
U1  31.75,12.7 0 top
U2  15.24,19.3 0 bottom
U3  30.48,19.05 90 top
U6  44.2,21.84 180 top
U7  15.49,19.05 180 top
U$2  [OSHW-LOGO-M]  86.16,11.56 90 bottom
V1  83.31,16.76 180 top
V2  11.43,35.56 90 top
V3  47.14,4.55 90 top
Y1  26.92,17.78 270 top

### Tracks (layer width: path | path; a pad name or v marks a point on that pad's centre or on a via)
3V3R  (via drill 0.35)
  Top 0.305: U3.3 30.48,17.55 | 30.48,17.55 U3.2 30.48,17.3 | 30.48,17.55 30.48,17.3 | 30.48,16.68 30.48,16.39 31.13,15.75 34.29,15.75 35.05,16.51 R1.2 40.36,21.96 C9.1 42.91,20.98 U6.5 | U3.10 30.73,21.08 30.99,21.34 30.99,21.84 30.48,22.35 29.46,22.35 28.89,21.78 v28.89,21.4 28.98,21.31 U3.13 | v30.57,16.59 30.48,16.68 | 30.48,16.68 30.48,17.3
  Bottom 0.305: v28.89,21.4 28.96,21.34 28.96,18.2 v30.57,16.59
!RST
  Top 0.305: P1.RST 41.25,15.29 30.68,15.29 29.72,16.26 29.72,17.54 U3.1
A0
  Bottom 0.305: P1.A0 39.84,6.54 J5.6
A1
  Bottom 0.305: P1.A1 35.97,7.87 37.34,7.87 38.84,6.37 J5.5
A2
  Bottom 0.305: P1.A2 34.19,7.11 36.58,7.11 37.84,5.85 J5.4
A3
  Bottom 0.305: P1.A3 32.41,6.35 36.07,6.35 36.84,5.58 J5.3
BATT-IN  (via drill 0.35)
  Top 0.305: v53.09,22.86 47.5,22.86 | 47.5,22.86 45.55,22.86 U6.3 | U6.1 47.31,20.89 47.5,21.08 C3.2 47.5,22.86 | Q1.2 61.02,22.29 61.98,21.34 65.68,21.34 D1.ANODE
  Top 0.508: v60.45,27.18 61.02,26.61 Q1.2
  Bottom 0.305: v53.09,22.86 53.34,22.86 57.66,27.18 v60.45,27.18
  Bottom 0.508: J1.1 60.45,33.51 v60.45,27.18
D3
  Top 0.305: G1.4 16.84,33.21 P1.D3
  Bottom 0.305: P1.D3 16.84,30.81 17.78,31.75 19.81,31.75 21.11,33.04 J4.5
DC-IN  (via drill 0.35)
  Top 0.508: D3.C 71.04,22.96 D2.ANODE 74.27,22.96 v76.71,25.4 76.71,22.49 Q3.2
  Bottom 0.508: v76.71,25.4 76.71,27.69 79.49,30.46 J2.1
EN  (via drill 0.35)
  Top 0.305: v36.32,26.67 37.11,26.67 Q2.3
  Bottom 0.305: P1.EN 36.32,27.84 v36.32,26.67
GND  (via drill 0.25, 0.35)
  Top 0.254: U3.5 31.23,18.3 U3.17
  other vias: 13.46,11.94 10.79,18.54 44.2,21.84 18.8,23.11 29.21,15.49 76.45,33.78 77.47,36.83 57.4,33.78 57.4,31.24 85.6,16.76 34.54,13.72 29.46,10.92 64.77,20.07 84.07,18.29 84.58,15.24 85.09,18.29 76.45,32.51 57.4,32.51 38.61,10.41 40.89,10.41 39.88,7.62 11.94,33.27 10.92,33.27 5.84,37.34 52.58,36.83 58.42,36.83 76.45,31.24 77.47,29.97 58.17,20.07 31.75,22.61 9.14,5.08 45.47,2.29 57.4,2.29 68.83,2.29 81.53,2.29 52.58,35.81 13.21,32.26 33.02,17.02 9.91,16.76 33.53,32.38 25.15,32.26 18.8,25.65 15.49,21.08 11.18,6.35 21.84,3.56 34.8,3.56 80.52,20.07 4.57,15.49 4.32,16.26 9.4,12.7 3.43,14.61 4.45,13.59 5.08,14.99 6.1,13.97 4.95,13.08 5.46,12.57 5.59,14.48 9.4,11.94 8.76,11.3 8,11.3 7.24,11.3 3.94,14.1 6.73,13.34 4.32,17.02 3.56,17.4 8.89,27.94
  pour Top (rank 2): -3.78,42.69 99.75,42.88 99.69,-4.02 -3.78,-4.22
  pour Bottom: -3.6,47.03 95.49,46.88 95.27,-3.18 -3.38,-3.15
LI+
  Top 0.508: P1.LI+ 43.87,29.54 48.51,24.89 54.53,24.89 56.03,23.39 56.03,19.32 56.92,18.44 61.37,18.44 61.98,19.05 Q1.3 63.11,19.11 C7.1
LORA-ANT
  Bottom 0.406: U2.9 6.75,12.3 3.3,15.75 J10.SIG
MISO
  Bottom 0.305: J6.3 23.88,5.83 23.37,6.35 19.71,6.35 P1.MI 16.84,18.5 U2.2
MOSI
  Bottom 0.305: J6.4 24.89,5.07 24.89,6.35 24.38,6.86 21.74,6.86 P1.MO 19.38,11.08 19.45,11.16 19.45,19.12 U2.3
N$1  (via drill 0.35)
  Top 0.508: D3.A v71.63,20.07
  Bottom 0.508: v71.63,20.07 72.24,20.68 JP7.2
N$2
  Top 0.305: Y1.1 27.15,18.8 U3.15
N$4  (via drill 0.35)
  Top 0.305: R7.2 R6.1 63.89,8.38 v61.56,8.38
  Bottom 0.305: SW1.P$1 v61.56,8.38 SW1.P$2
N$5
  Top 0.508: F1.1 78.79,20.24 Q3.3 78.86,19.11 C6.1
N$6
  Top 0.305: U3.16 28.06,18.3 26.92,17.16 Y1.2
N$9  (via drill 0.35)
  Top 0.305: v66.04,28.96 66.04,27.58 D1.CATHODE D2.CATHODE 72.59,26.31 74.06,27.78 74.06,28.98 R2.2 75.18,32.77 v72.64,35.31
  Bottom 0.305: v72.64,35.31 72.6,35.27 S1.1
N$11
  Top 0.305: U3.14 28.58,19.3 27.18,20.7 C11.2
N$12  (via drill 0.35)
  Top 0.305: R9.2 73.15,32 v72.64,32.51
  Bottom 0.305: v72.64,32.51 71.63,32.51 71.08,31.97 S1.3
ON/OFF  (via drill 0.35)
  Top 0.305: Q3.1 78.68,27.5 77.86,28.31 R2.1 75.18,26.42 73.15,24.38 v69.09,24.38 65.79,24.38 63.83,22.43 Q1.1
  Bottom 0.305: S1.2 67.56,31.79 67.56,28.45 69.09,26.92 v69.09,24.38
PSW
  Top 0.305: U3.4 31.23,16.78 31.75,16.26 33.78,16.26 34.29,16.76 34.29,20.83 33.78,21.34 33.78,22.86 34.68,23.76 R1.1 35.14,23.85 Q2.1
RFM-INT  (via drill 0.35)
  Top 0.305: v16.51,36.58 17.02,36.06 G1.5
  Bottom 0.305: v16.51,36.58 19.29,33.8 J4.6 20.11,33.06 19.3,32.26 17.02,32.26 P1.D2 12.34,31.5 5.84,31.5 2.79,28.45 2.79,24.89 5.38,22.3 U2.14
RFM-RST  (via drill 0.35)
  Top 0.305: R8.1 10.16,14.73 10.79,14.1 21.72,14.1 v24.38,16.76
  Bottom 0.305: U2.6 23.92,16.3 v24.38,16.76 26.67,19.05 26.67,27.33 P1.D6
RFM-SS  (via drill 0.35)
  Top 0.305: R3.1 8.64,17.02 10.92,14.73 20.07,14.73 v24.13,18.8
  Bottom 0.305: U2.5 23.64,18.3 v24.13,18.8 25.15,19.81 25.15,26.31 P1.D5
RX
  Bottom 0.305: P1.RX 14.3,5.04 J7.4
SCK
  Bottom 0.305: J6.5 25.91,5.09 25.91,6.6 24.89,7.62 23.52,7.62 P1.SCK 21.92,10.08 20.57,11.43 20.57,18.24 U2.4
SCL  (via drill 0.35)
  Top 0.305: v22.11,32.27 20.34,34.04 16.26,34.04 15.61,33.39 G1.3 14.42,32.2 P1.SCL | U3.7 32.76,19.3 33.27,19.81 33.27,20.55 32.87,20.96 32.87,23.57 32.26,24.18 13.99,24.18 v11.76,26.42 | R5.1 9.65,19.3 v9.91,19.56 10.04,19.56 10.3,19.3 U7.6
  Bottom 0.305: J9.4 30.5,33.04 28.96,31.5 22.86,31.5 22.11,32.25 v22.11,32.27 J4.4 | P1.SCL v11.76,26.42 11.76,21.41 v9.91,19.56
SDA  (via drill 0.35)
  Top 0.305: P1.SDA 12.7,33.02 12.7,34.54 13.45,35.29 G1.1 15.47,35.29 16.26,34.49 22.28,34.49 v23.11,35.32 | U3.6 33.02,18.8 33.78,19.56 33.78,20.69 33.33,21.15 33.33,23.82 32.51,24.64 14.65,24.64 9.75,29.54 P1.SDA | 9.15,20.95 9.98,21.78 9.98,28.78 P1.SDA | U7.5 13.21,19.8 12.05,20.95 9.15,20.95 | R4.1 8.14,20.95 9.15,20.95
  Bottom 0.305: J9.3 31.5,34.54 30.99,35.05 23.38,35.05 v23.11,35.32 J4.3
SS
  Bottom 0.305: P1.A5 26.88,6.8 J6.6
TEMP
  Top 0.305: U1.1 29.93,13.65 28.92,12.64 27.63,12.64 26.92,11.94 26.92,9.3 P1.A4
TX
  Bottom 0.305: P1.TX 13.2,7.78 J7.3
USER-SW
  Top 0.305: R7.1 62.99,9.79 C10.1 57.77,9.79 54.61,12.95 54.61,22.86 53.9,23.57 47.8,23.57 43.99,27.38 21.54,27.38 P1.D4
VCC  (via drill 0.35)
  Top 0.305: 35.56,14.73 35.56,12.7 34.61,11.75 U1.4 31.92,12.7 U1.2 29.63,12.7 28.73,11.8 C2.1 | F3.1 62.17,6.17 63.11,7.11 R6.2 | C1.1 13.61,18.3 U7.8
  Top 0.406: C1.1 11.68,16.63 10.15,18.16 6.34,18.16 6.21,18.03
  Top 0.508: F3.1 48.8,7.37 46.63,7.37 P1.3V3 44.7,9.22 39.19,14.73 35.56,14.73 27.53,14.73 26.26,13.46 8.37,13.46 7.1,14.73 R8.2 6.21,15.49 R3.2 6.21,18.03 R5.2 6.21,20.19 | F2.1 7.87,32.38 7.87,26.67 7.48,26.67 C12.1 6.3,25.32 C4.P$1 6.21,23.28 R4.2 6.21,20.19 | v5.21,20.19 6.21,20.19
  Bottom 0.508: 7.82,20.32 U2.13 5.32,20.3 v5.21,20.19
VCC2-EXT  (via drill 0.35)
  Top 0.508: F2.2 9.15,36.46 V2.2 12.08,36.46 13.46,37.85 22.86,37.85 24.11,36.6 | v32.5,32.4 32.5,36.31 32.51,36.32 30.99,37.85 25.35,37.85 24.11,36.6 | v24.11,32.27 24.11,36.6
  Bottom 0.508: v32.5,32.4 J9.2 | v24.11,32.27 J4.2
VCC-EXT  (via drill 0.35)
  Top 0.508: F3.2 47.91,5.45 V3.2 46.6,5.45 42.16,1.02 37.59,1.02 v35.81,2.79 34.04,1.02 24.64,1.02 v22.86,2.79 20.95,0.89 14.1,0.89 v12.19,2.79
  Bottom 0.508: v12.19,2.79 J7.2 | v22.86,2.79 22.86,5.04 J6.2 | J5.2 35.81,5.04 v35.81,2.79
VUSB  (via drill 0.35)
  Top 0.508: F1.2 82.3,16.88 V1.2 78.23,16.76 v77.47,16 75.69,17.78 56.64,17.78 55.37,19.05 55.37,23.11 54.36,24.13 48.26,24.13 44.45,27.94 33.68,27.94 P1.VUSB
  Bottom 0.508: C8.P$1 v77.47,16
WAKE  (via drill 0.35)
  Top 0.305: v30.23,21.59 U3.11
  Bottom 0.305: P1.D8 30.23,28.85 v30.23,21.59

### Text on the board
bNames: I2C w/ Interrupts | Qwiic | Power Switch | OFF | v1.7 - 4-28-21 | chip@seeinsights.com | + | ON | + | LiPO Battery | DC - IN | Over Voltage Protection - / JP7 must be closed for Argon / Not required for Boron | User Btn | LoRA | Analog | Serial | SPI Bus